# EAGLE design arduino-base (EAGLE 5.12)
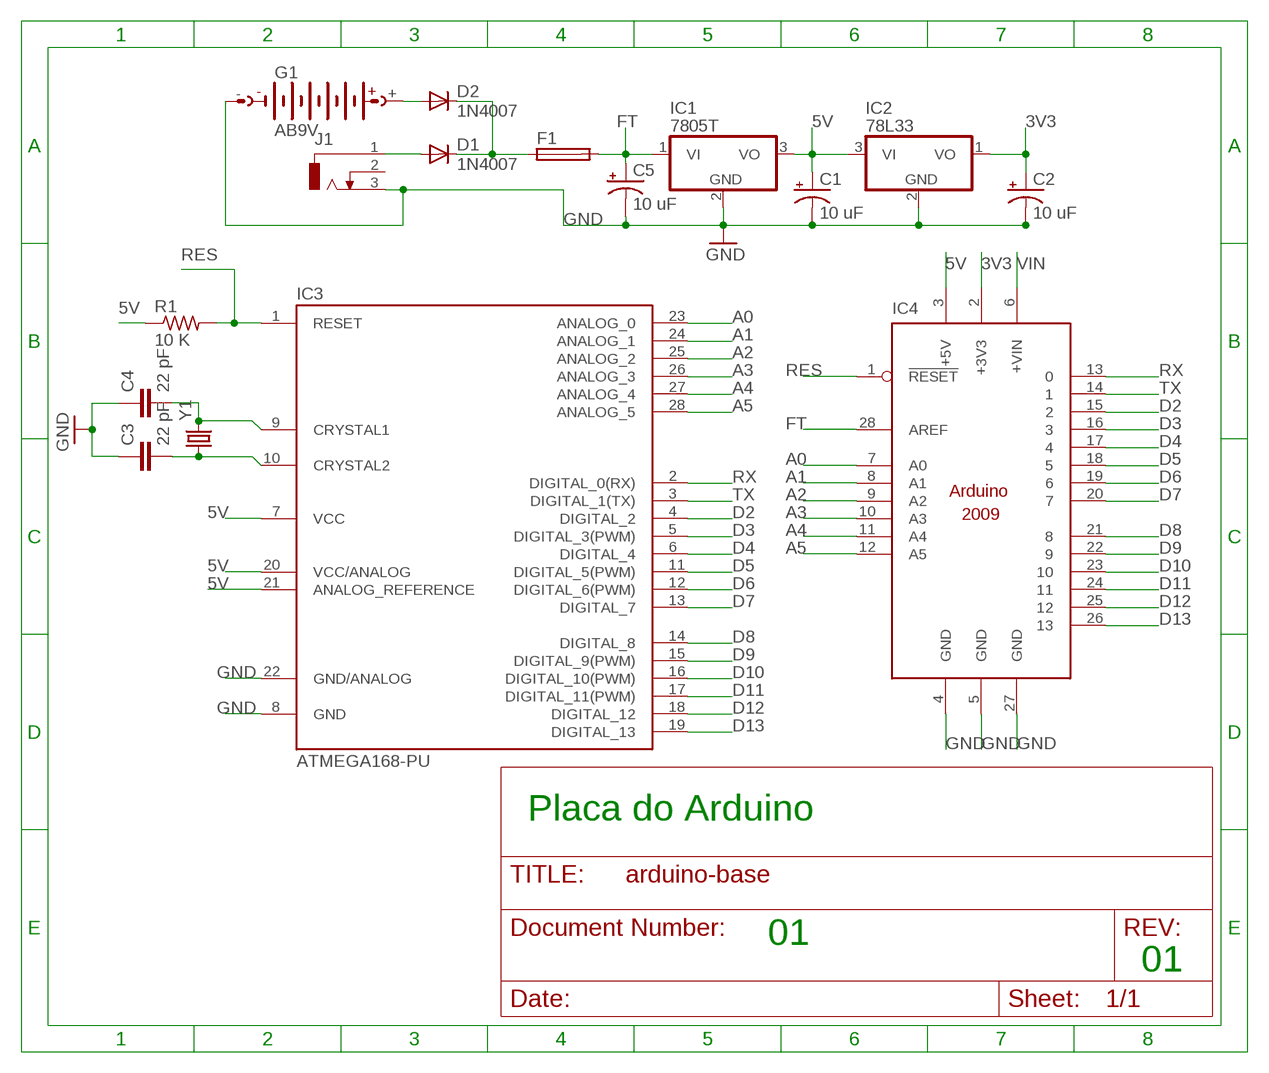
[diagram p0: schematic, sheet 1]

## Parts
C1  10 uF  CAP_POLPTH1  [CPOL-RADIAL-100UF-25V]
C2  10 uF  CAP_POLPTH1  [CPOL-RADIAL-100UF-25V]
C3  22 pF  CAPPTH2  [CAP-PTH-SMALL2]
C4  22 pF  CAPPTH2  [CAP-PTH-SMALL2]
C5  10 uF  CAP_POLPTH1  [CPOL-RADIAL-100UF-25V]
D1  1N4007  1N4004  [DO41-10]
D2  1N4007  1N4004  [DO41-10]
F1  FUSEBLANK_5X20MM  [FUSE_HOLDER_5X20MM]
G1  AB9V  [AB9V]
IC1  7805T  [TO220H]
IC2  78L33  7805L  [TO92]
IC3  ATMEGA168-PU  [DIL28-3]
IC4  ARDUINO2009_12  [ARDUINO2009_2]
J1  DCJ0303  [DCJ0303]
R1  10 K  R-US_0204/7  [0204/7]
Y1  CRYSTALHC49US  [HC49US]

## Nets
3V3: C2.1(+) IC2.1(VO) IC4.2(+3V3)
5V: C1.1(+) IC1.3(VO) IC2.3(VI) IC3.7(VCC) IC3.20(VCC/ANALOG) IC3.21(ANALOG_REFERENCE) IC4.3(+5V) R1.1
A0: IC3.23(ANALOG_0) IC4.7(A0)
A1: IC3.24(ANALOG_1) IC4.8(A1)
A2: IC3.25(ANALOG_2) IC4.9(A2)
A3: IC3.26(ANALOG_3) IC4.10(A3)
A4: IC3.27(ANALOG_4) IC4.11(A4)
A5: IC3.28(ANALOG_5) IC4.12(A5)
D2: IC3.4(DIGITAL_2) IC4.15
D3: IC3.5(DIGITAL_3(PWM)) IC4.16
D4: IC3.6(DIGITAL_4) IC4.17
D5: IC3.11(DIGITAL_5(PWM)) IC4.18
D6: IC3.12(DIGITAL_6(PWM)) IC4.19
D7: IC3.13(DIGITAL_7) IC4.20
D8: IC3.14(DIGITAL_8) IC4.21
D9: IC3.15(DIGITAL_9(PWM)) IC4.22
D10: IC3.16(DIGITAL_10(PWM)) IC4.23
D11: IC3.17(DIGITAL_11(PWM)) IC4.24
D12: IC3.18(DIGITAL_12) IC4.25
D13: IC3.19(DIGITAL_13) IC4.26
FT: C5.1(+) F1.2 IC1.1(VI) IC4.28(AREF)
GND: C1.2(-) C2.2(-) C3.1 C4.1 C5.2(-) G1.- IC1.2(GND) IC2.2(GND) IC3.8(GND) IC3.22(GND/ANALOG) IC4.4(GND) IC4.5(GND) IC4.27(GND) J1.3
N$1: D1.A J1.1
N$3: C3.2 IC3.10(CRYSTAL2) Y1.1
N$4: D1.C D2.C F1.1
N$5: C4.2 IC3.9(CRYSTAL1) Y1.2
N$7: D2.A G1.+
RES: IC3.1(RESET) IC4.1(!RESET) R1.2
RX: IC3.2(DIGITAL_0(RX)) IC4.13
TX: IC3.3(DIGITAL_1(TX)) IC4.14
VIN: IC4.6(+VIN)
Unconnected: J1.2

## Notes on the sheet
- Placa do Arduino
- 01
- 01

## Library data of the parts
C1 C2 C5 = SparkFun:CAP_POL: Capacitor Polarized These are standard SMD and PTH capacitors. Normally 10uF, 47uF, and 100uF in electrolytic and tantalum varieties. Always verify the external diameter of the through hole cap, it varies with capacity, voltage, and manufacturer. The EIA devices should be standard.
C3 C4 = SparkFun:CAP: Capacitor Standard 0603 ceramic capacitor, and 0.1" leaded capacitor.
D1 D2 = diode:1N4004: DIODE general purpose rectifier, 1 A
F1 = fuse:FUSE: Fuse; OC_FARNELL: unknown; OC_NEWARK: unknown
G1 = battery:AB9V: 9-V BATTERY CLIP
IC1 IC2 = linear:78*: Positive VOLTAGE REGULATOR Source: http://cache.national.com/ds/LM/LM78L05.pdf http://www.fairchildsemi.com/ds/LM/LM7805.pdf
IC3 = Arduino-AVR:ATMEGA168-PU
IC4 = arduino:ARDUINO2009_1: The Arduino Duemilanove ("2009") is a microcontroller board based on the ATmega168 or ATmega328. - 14 digital input/output pins (of which 6 can be used as PWM outputs) - 6 analog inputs, a 16 MHz crystal oscillator - USB connection - power jack - ISP header - reset button It contains everything needed to support the microcontroller; simply connect it to a computer with a USB cable or power it with a AC-to-DC adapter or battery to get started http://arduino.cc/en/Main/ArduinoBoardDuemilanove
J1 = con-jack:DCJ0303: DC POWER JACK Source: DCJ0303.pdf; OC_FARNELL: unknown; OC_NEWARK: unknown
R1 = resistor:R-US_: RESISTOR, American symbol
Y1 = SparkFun:CRYSTAL: Crystals Various standard crystals. Proven footprints. Spark Fun Electronics SKU : COM-00534

## Board
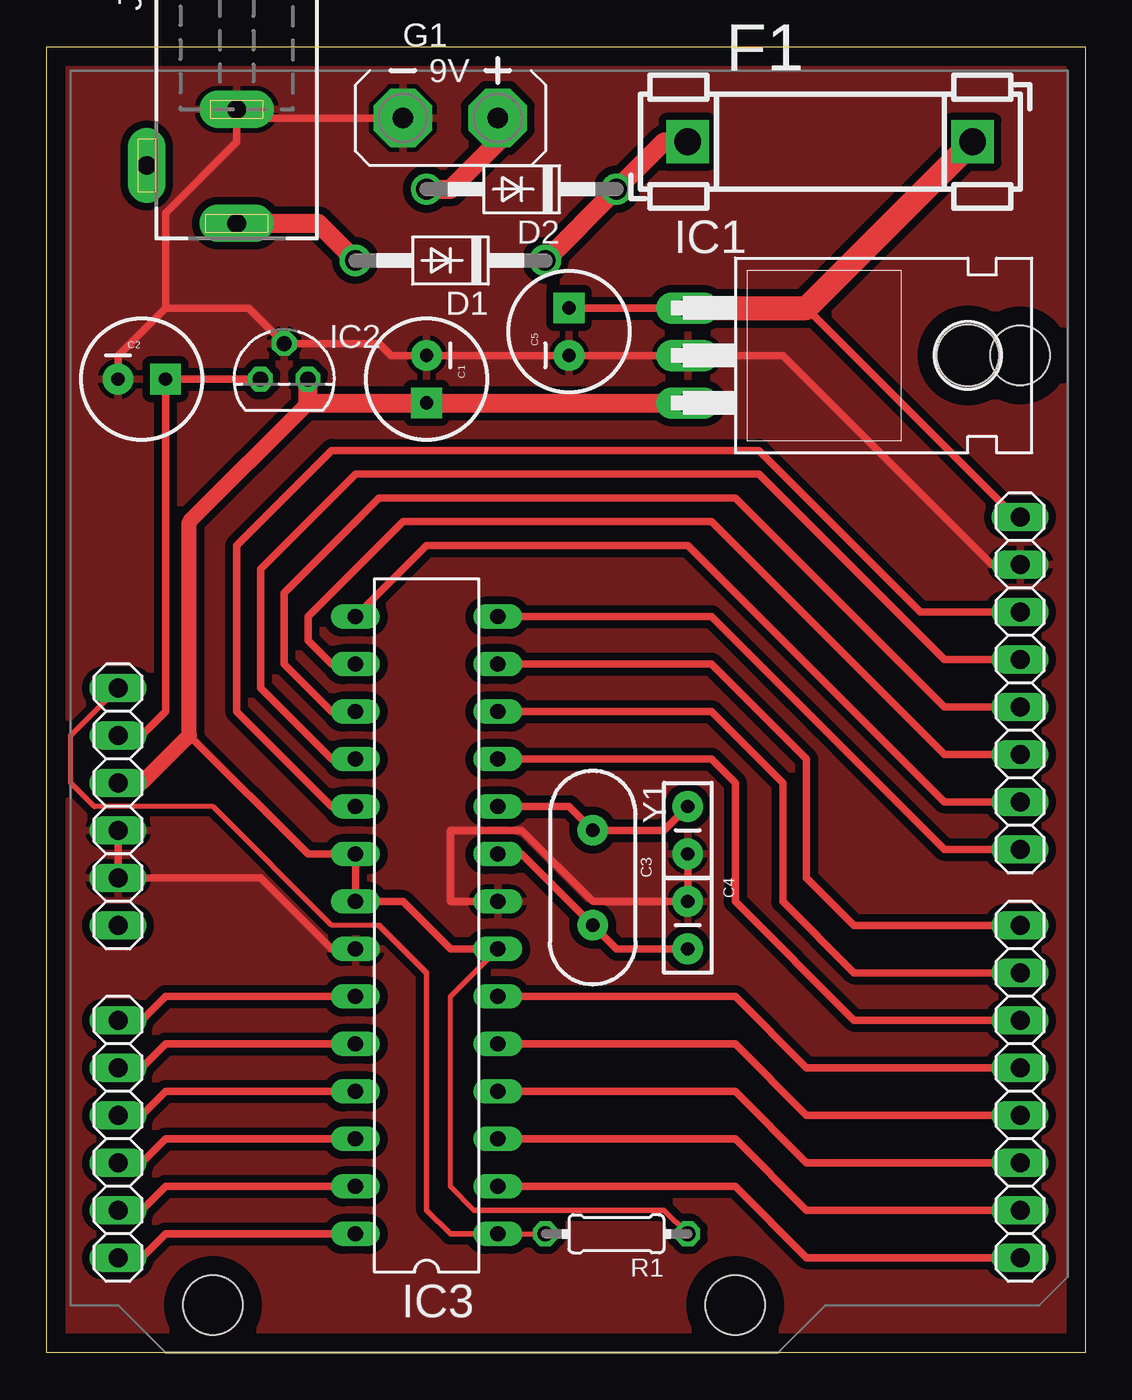
[diagram p1: board, top side]

Size 55.55 x 69.86 mm. Coordinates in mm from the lower left corner, seen from the top.
Outline: 0,69.86 55.55,69.86 55.55,0 0,0 0,69.86
Copper layers (1*16): Top 0.035mm / dielectric 1.5mm / Bottom 0.035mm
Design rules "default *": minimum track width 10mil, minimum drill 24mil, track to track 16mil, track to pad 16mil, pad to pad 16mil, via to via 16mil, smd to smd 16mil, copper to edge 40mil, drill to drill 8mil, minimum pad ring 10mil, minimum via ring 8mil, stop-mask expansion 4mil, vias tented up to drill 0mil, thermal gap 10mil

### Footprints (pad centres in the part's own frame; a part is rotated, then mirrored left to right if it is on the bottom)
CPOL-RADIAL-100UF-25V = drill 0.7 pad 1.651 square: 1 1.27,0 | drill 0.7 pad 1.651 round: 2 -1.27,0
CAP-PTH-SMALL2 = drill 0.7 pad 1.651 round: 1 0,0; 2 2.54,0
DO41-10 = drill 1.118 round: A 5.08,0; C -5.08,0
FUSE_HOLDER_5X20MM = drill 1.422 pad 2.286 square: 1 0,0; 2 15.24,0
AB9V = drill 1.118 pad 3.15 octagon: + 0,2.54; - 0,-2.54
TO220H = drill 1.118 long: 1 -2.54,-10.16; 2 0,-10.16; 3 2.54,-10.16 | hole 3.302: 0,4.826
TO92 = drill 0.813 octagon: 1 -1.27,0; 2 0,1.905; 3 1.27,0
DIL28-3 = drill 0.813 long: 1 -16.51,-3.81; 2 -13.97,-3.81; 3 -11.43,-3.81; 4 -8.89,-3.81; 5 -6.35,-3.81; 6 -3.81,-3.81; 7 -1.27,-3.81; 8 1.27,-3.81; 9 3.81,-3.81; 10 6.35,-3.81; 11 8.89,-3.81; 12 11.43,-3.81; 13 13.97,-3.81; 14 16.51,-3.81; 15 16.51,3.81; 16 13.97,3.81; 17 11.43,3.81; 18 8.89,3.81; 19 6.35,3.81; 20 3.81,3.81; 21 1.27,3.81; 22 -1.27,3.81; 23 -3.81,3.81; 24 -6.35,3.81; 25 -8.89,3.81; 26 -11.43,3.81; 27 -13.97,3.81; 28 -16.51,3.81
ARDUINO2009_2 = drill 1.016 long: 1 33.02,2.54; 2 35.56,2.54; 3 38.1,2.54; 4 40.64,2.54; 5 43.18,2.54; 6 45.72,2.54; 7 50.8,2.54; 8 53.34,2.54; 9 55.88,2.54; 10 58.42,2.54; 11 60.96,2.54; 12 63.5,2.54; 13 63.5,50.8; 14 60.96,50.8; 15 58.42,50.8; 16 55.88,50.8; 17 53.34,50.8; 18 50.8,50.8; 19 48.26,50.8; 20 45.72,50.8; 21 41.656,50.8; 22 39.116,50.8; 23 36.576,50.8; 24 34.036,50.8; 25 31.496,50.8; 26 28.956,50.8; 27 26.416,50.8; 28 23.876,50.8 | hole 3.2: 15.24,50.8; 66.04,35.56; 66.04,7.62
DCJ0303 = drill 1 pad 2 long: 1 0,3.1; 2 4.8,0; 3 0,-3
0204/7 = drill 0.813 octagon: 1 -3.81,0; 2 3.81,0
HC49US = drill 0.7 pad 1.651 round: 1 -2.54,0; 2 2.54,0

### Placement (x,y rotation side)
C1  20.32,52.08 270 top
C2  5.08,52.08 0 top
C3  34.29,26.68 90 top
C4  34.29,24.14 270 top
C5  27.94,54.62 90 top
D1  21.59,58.43 180 top
D2  25.4,62.24 180 top
F1  34.29,64.78 0 top
G1  21.59,66.05 270 top
IC1  44.45,53.35 270 top
IC2  12.7,52.08 0 top
IC3  20.32,22.87 90 top
IC4  1.27,68.59 270 top
J1  10.16,63.51 180 top
R1  30.48,6.36 180 top
Y1  29.21,25.41 270 top

### Tracks (layer width: path | path; a pad name or v marks a point on that pad's centre or on a via)
3V3
  Top 0.406: IC4.2 5.08,33.03 6.35,34.3 C2.1 IC2.1
5V
  Top 0.254: IC3.7 21.59,19.06 21.59,8.9 22.86,7.63
  Top 0.305: 22.86,7.63 33.02,7.63 R1.1
  Top 0.406: IC3.7 21.59,21.6 19.05,24.14 IC3.21 IC3.20 13.97,26.68 7.62,33.03
  Top 0.813: IC4.3 5.08,30.49 7.62,33.03 7.62,44.46 13.97,50.81
  Top 1.016: IC1.3 C1.1 13.97,50.81 IC2.3
A0
  Top 0.406: IC4.7 5.08,17.79 6.35,19.06 IC3.23
A1
  Top 0.406: IC4.8 5.08,15.25 6.35,16.52 IC3.24
A2
  Top 0.406: IC4.9 5.08,12.71 6.35,13.98 IC3.25
A3
  Top 0.406: IC4.10 5.08,10.17 6.35,11.44 IC3.26
A4
  Top 0.406: IC4.11 5.08,7.63 6.35,8.9 IC3.27
A5
  Top 0.406: IC4.12 5.08,5.09 6.35,6.36 IC3.28
D2
  Top 0.406: IC4.15 40.64,10.17 36.83,13.98 IC3.4
D3
  Top 0.406: IC4.16 40.64,12.71 36.83,16.52 IC3.5
D4
  Top 0.406: IC3.6 36.83,19.06 40.64,15.25 IC4.17
D5
  Top 0.406: IC4.18 43.18,17.79 36.83,24.14 36.83,30.49 35.56,31.76 IC3.11
D6
  Top 0.406: IC4.19 43.18,20.33 39.37,24.14 39.37,30.49 35.56,34.3 IC3.12
D7
  Top 0.406: IC4.20 43.18,22.87 40.64,25.41 40.64,31.76 35.56,36.84 IC3.13
D8
  Top 0.406: IC4.21 48.01,26.93 35.56,39.38 IC3.14
D9
  Top 0.406: IC4.22 48.01,29.47 34.29,43.19 20.32,43.19 IC3.15
D10
  Top 0.406: IC4.23 48.01,32.01 35.56,44.46 19.05,44.46 13.97,39.38 13.97,38.11 15.24,36.84 IC3.16
D11
  Top 0.406: IC4.24 48.01,34.55 36.83,45.73 17.78,45.73 12.7,40.65 12.7,36.84 15.24,34.3 IC3.17
D12
  Top 0.406: IC4.25 48.01,37.09 38.1,47 16.51,47 11.43,41.92 11.43,35.57 15.24,31.76 IC3.18
D13
  Top 0.406: IC4.26 46.74,39.63 38.1,48.27 15.24,48.27 10.16,43.19 10.16,34.3 15.24,29.22 IC3.19
FT
  Top 0.406: IC4.28 51.82,44.71 40.64,55.89 | C5.1 IC1.1
  Top 1.27: IC1.1 40.64,55.89 F1.2
GND
  Top 0.406: IC3.8 21.59,24.14 21.59,27.95 25.4,27.95 29.21,24.14 C4.1 C3.1 | IC1.2 C1.2 18.41,53.35 17.78,53.98 IC2.2 10.79,55.89 6.35,55.89 | IC3.22 15.24,21.6 11.43,25.41 IC4.5 IC4.4 | IC4.27 50.55,42.17 39.37,53.35 IC1.2 | G1.- 10.62,66.05 J1.3 10.16,64.78 6.35,60.97 6.35,55.89 | IC1.2 C5.2 | C2.2 3.81,53.35 6.35,55.89
  pour Top: 0,0.01 0,69.86 55.88,69.86 55.88,68.59 55.88,0.01
N$1
  Top 1.016: J1.1 14.53,60.41 D1.A
N$3
  Top 0.406: IC3.10 27.94,29.22 Y1.1 33.02,27.95 C3.2
N$4
  Top 1.016: D1.C D2.C 33.02,64.78 F1.1
N$5
  Top 0.406: C4.2 30.48,21.6 Y1.2 25.4,26.68 IC3.9
N$7
  Top 1.016: D2.A 21.59,62.24 24.13,64.78 G1.+
RES
  Top 0.254: R1.2 IC3.1 22.86,6.36 | 17.78,22.87 15.24,22.87 8.89,29.22 2.54,29.22 1.27,30.49 1.27,33.03 IC4.1
  Top 0.305: 22.86,6.36 21.59,6.36 20.32,7.63 20.32,20.33 17.78,22.87
RX
  Top 0.406: IC4.13 40.64,5.09 36.83,8.9 IC3.2
TX
  Top 0.406: IC4.14 40.64,7.63 36.83,11.44 IC3.3